# EAGLE schematic ADC3_2M (EAGLE 9.6.2)
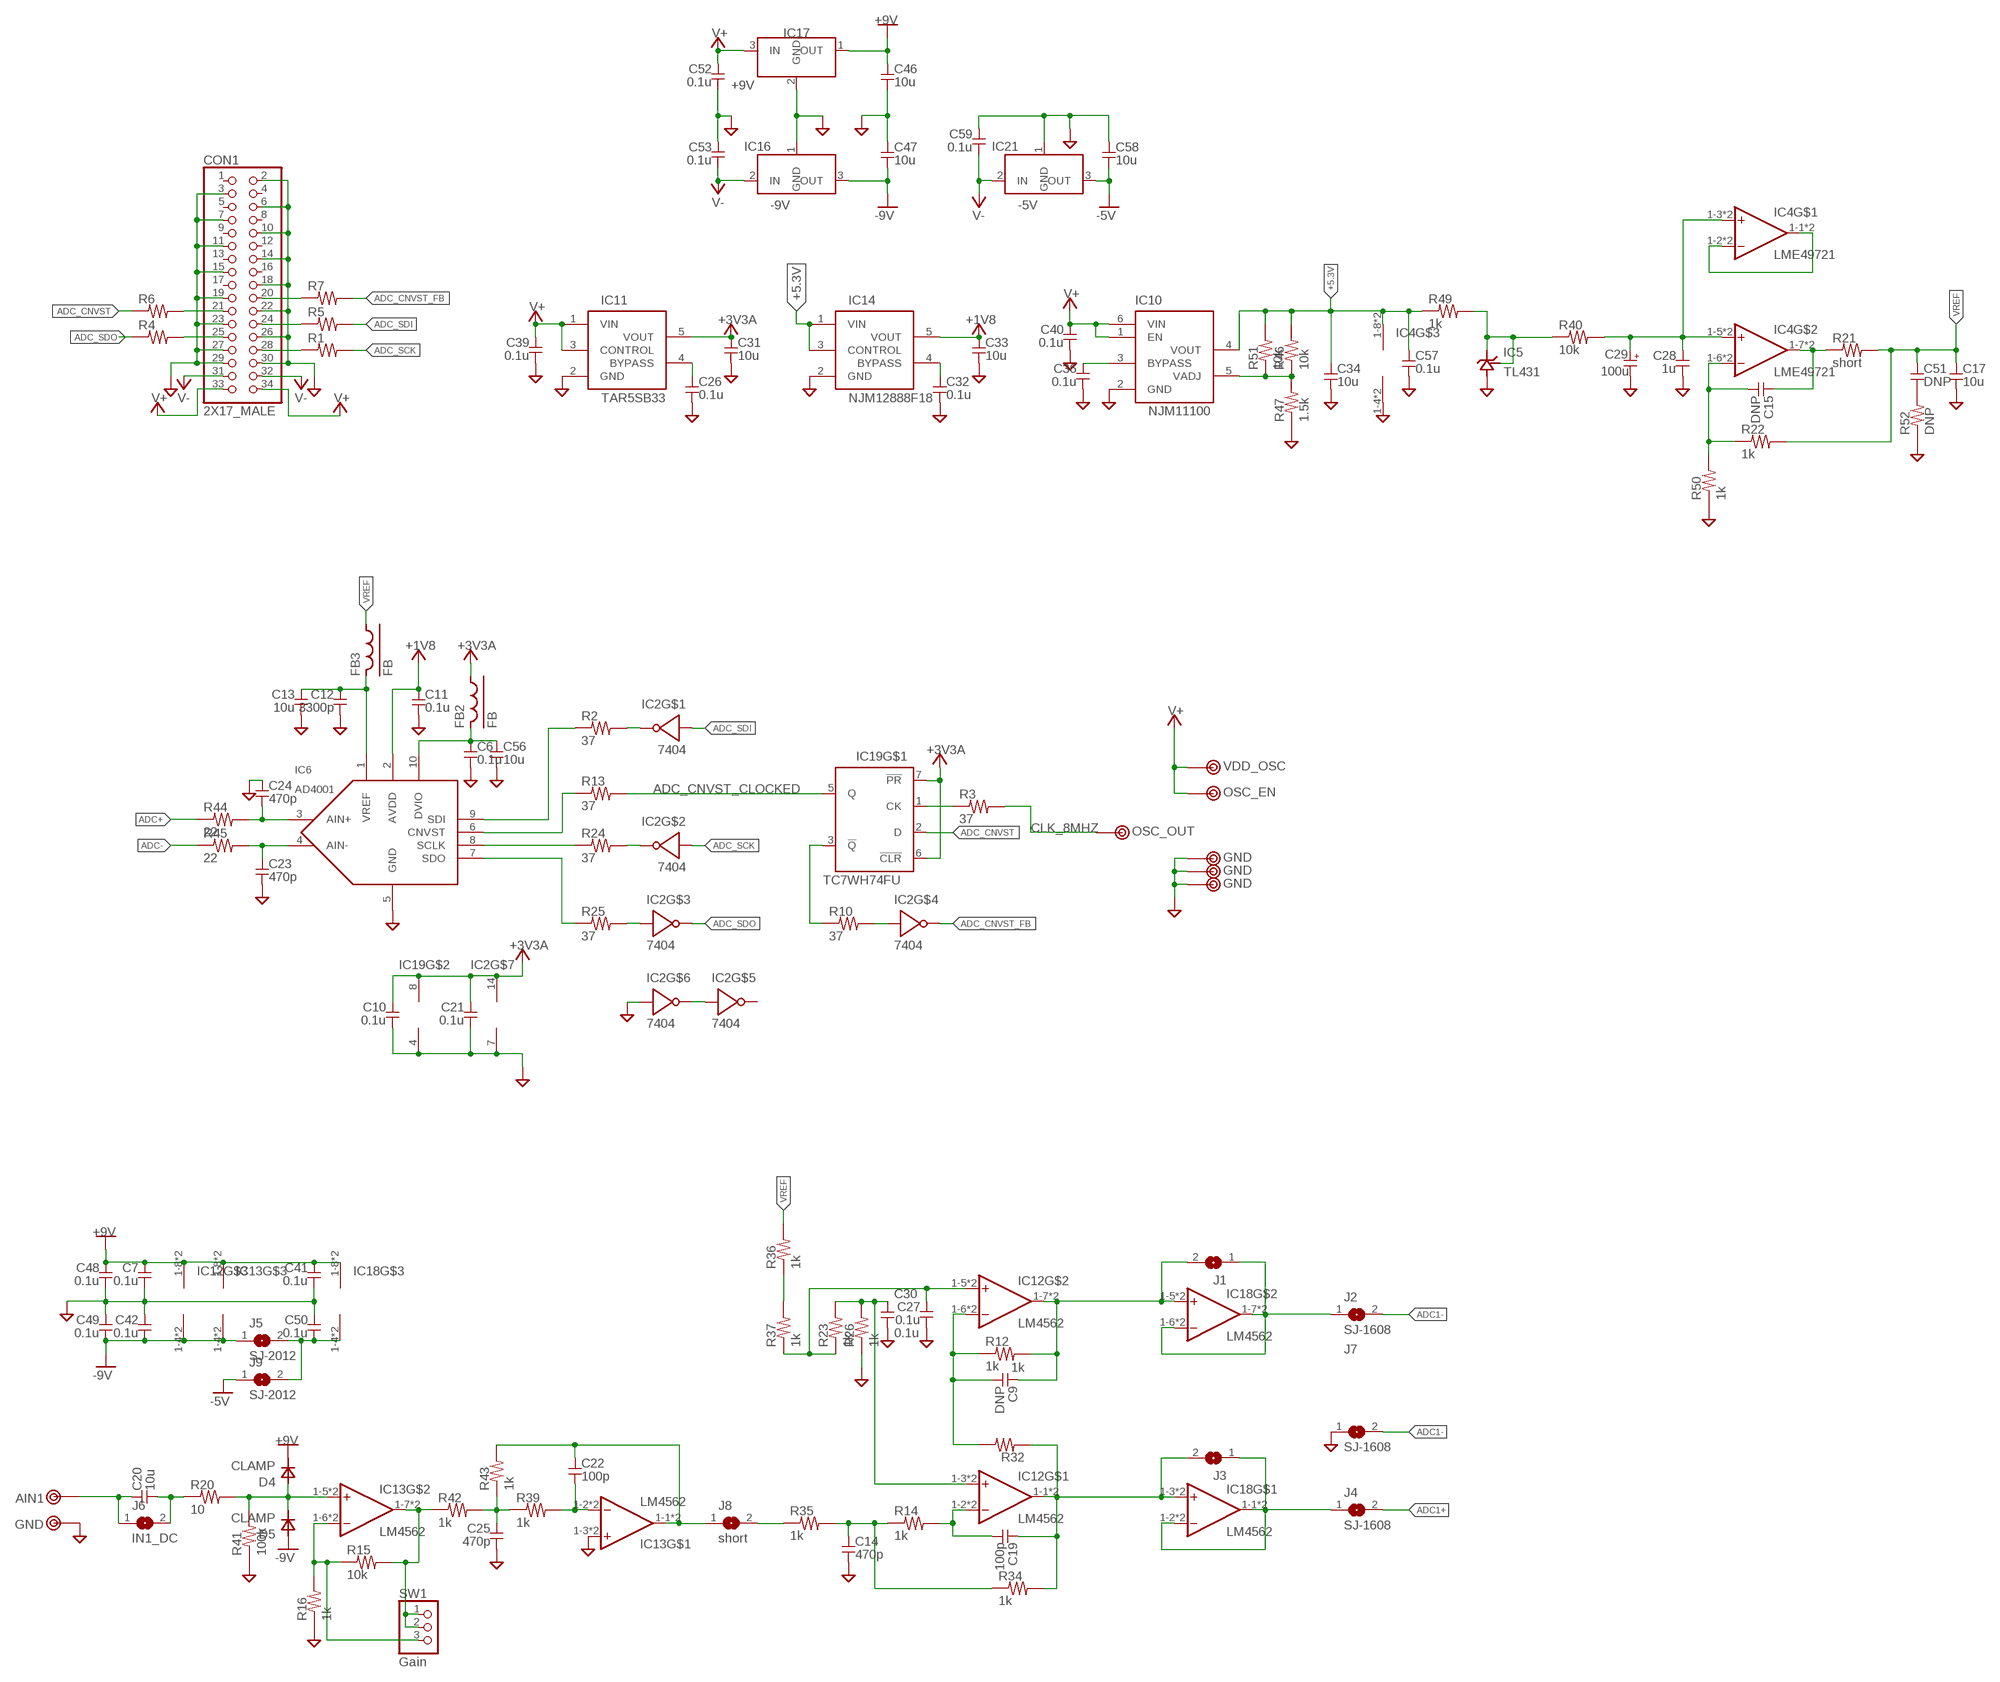
[diagram p0: schematic, sheet 1]

## Parts
C6  0.1u  C-1608  [1608]
C7  0.1u  C-1608  [1608]
C9  DNP  C-1608  [1608]
C10  0.1u  C-1608  [1608]
C11  0.1u  C-1608  [1608]
C12  3300p  C-1608  [1608]
C13  10u  C-2012  [2012]
C14  470p  C-1608  [1608]
C15  DNP  C-1608  [1608]
C17  10u  C-2012  [2012]
C19  100p  C-1608  [1608]
C20  10u  C-5  [C050]
C21  0.1u  C-1608  [1608]
C22  100p  C-1608  [1608]
C23  470p  C-1608  [1608]
C24  470p  C-1608  [1608]
C25  470p  C-1608  [1608]
C26  0.1u  C-1608  [1608]
C27  0.1u  C-1608  [1608]
C28  1u  C-1608  [1608]
C29  100u  CPOLE2.5-6.5  [E2.5-6.5]
C30  0.1u  C-1608  [1608]
C31  10u  C-2012  [2012]
C32  0.1u  C-1608  [1608]
C33  10u  C-2012  [2012]
C34  10u  C-2012  [2012]
C36  0.1u  C-1608  [1608]
C39  0.1u  C-1608  [1608]
C40  0.1u  C-1608  [1608]
C41  0.1u  C-1608  [1608]
C42  0.1u  C-1608  [1608]
C46  10u  C-3216  [3216]
C47  10u  C-3216  [3216]
C48  0.1u  C-1608  [1608]
C49  0.1u  C-1608  [1608]
C50  0.1u  C-1608  [1608]
C51  DNP  C-2012  [2012]
C52  0.1u  C-1608  [1608]
C53  0.1u  C-1608  [1608]
C56  10u  C-2012  [2012]
C57  0.1u  C-1608  [1608]
C58  10u  C-2012  [2012]
C59  0.1u  C-1608  [1608]
CON1  2X17_MALE  [2X17/90]
D4  CLAMP  DIODE-1N4148W  [SOD123]
D5  CLAMP  DIODE-1N4148W  [SOD123]
FB2  FB  [1608-J]
FB3  FB  [1608-J]
IC2  7404  [TSSOP14]
IC4  LME49721  OPA-2-DUAL  [DIL8-SOP8]
IC5  TL431  [TO-92]
IC6  AD4001  MCP331X1  [MSOP10]
IC10  NJM11100  [SOT23-6]
IC11  TAR5SB33  [SOT23-5]
IC12  LM4562  OPA-2-DUAL  [DIL8-SOP8]
IC13  LM4562  OPA-2-DUAL  [DIL8-SOP8]
IC14  NJM12888F18  NJM12888  [SOT23-5]
IC16  -9V  79LX  [TO-92]
IC17  +9V  78LX  [TO-92]
IC18  LM4562  OPA-2-DUAL  [DIL8-SOP8]
IC19  TC7WH74FU  [SSOP8-P-0.65]
IC21  -5V  79LX  [TO-92]
J1  SJ-2012  [2012-J]
J2  SJ-1608  [1608-J]
J3  SJ-2012  [2012-J]
J4  SJ-1608  [1608-J]
J5  SJ-2012  [2012-J]
J6  IN1_DC  SJ-2012  [2012-J]
J7  SJ-1608  [1608-J]
J8  short  SJ-2012  [2012-J]
J9  SJ-2012  [2012-J]
R1  R-1608J  [1608-J]
R2  37  R-1608J  [1608-J]
R3  37  R-1608J  [1608-J]
R4  R-1608J  [1608-J]
R5  R-1608J  [1608-J]
R6  R-1608J  [1608-J]
R7  R-1608J  [1608-J]
R10  37  R-1608J  [1608-J]
R12  1k  R-1608  [1608]
R13  37  R-1608J  [1608-J]
R14  1k  R-1608  [1608]
R15  10k  R-1608  [1608]
R16  1k  R-1608  [1608]
R20  10  R-1608J  [1608-J]
R21  short  R-1608J  [1608-J]
R22  1k  R-1608  [1608]
R23  1k  R-1608  [1608]
R24  37  R-1608J  [1608-J]
R25  37  R-1608J  [1608-J]
R26  1k  R-1608  [1608]
R32  1k  R-1608  [1608]
R34  1k  R-1608  [1608]
R35  1k  R-1608  [1608]
R36  1k  R-1608  [1608]
R37  1k  R-1608  [1608]
R39  1k  R-1608  [1608]
R40  10k  R-1608  [1608]
R41  100k  R-1608  [1608]
R42  1k  R-1608  [1608]
R43  1k  R-1608  [1608]
R44  22  R-1608  [1608]
R45  22  R-1608  [1608]
R46  10k  R-1608  [1608]
R47  1.5k  R-1608  [1608]
R49  1k  R-1608  [1608]
R50  1k  R-1608  [1608]
R51  10k  R-1608  [1608]
R52  DNP  R-2012  [2012]
SW1  Gain  SW-1X3  [1X03]
TP2  AIN1  TESTPIN-BIG  [TESTPIN-BIG]
TP16  GND  TESTPIN-BIG  [TESTPIN-BIG]
TP24  VDD_OSC  TESTPIN  [TESTPIN]
TP25  OSC_EN  TESTPIN  [TESTPIN]
TP26  OSC_OUT  TESTPIN  [TESTPIN]
TP27  GND  TESTPIN  [TESTPIN]
TP28  GND  TESTPIN  [TESTPIN]
TP29  GND  TESTPIN  [TESTPIN]

## Nets
+1V8: C11.1 C33.1 IC6.2(AVDD) IC14.5(VOUT)
+3V3A: C10.1 C21.1 C31.1 FB2.1 IC2.14(V+) IC11.5(VOUT) IC19.6(!CLR) IC19.7(!PR) IC19.8(V+)
+5.3V: C34.1 C57.1 IC4.1-8(V+) IC4.2-8(V+) IC10.4(VOUT) IC14.1(VIN) IC14.3(CONTROL) R46.2 R49.1 R51.2
+9V: C7.1 C41.1 C46.1 C48.1 D4.2(K) IC12.1-8(V+) IC12.2-8(V+) IC13.1-8(V+) IC13.2-8(V+) IC17.1(OUT) IC18.1-8(V+) IC18.2-8(V+)
-5V: C58.2 IC21.3(OUT) J9.1
-9V: C42.2 C47.2 C49.2 D5.1(A) IC12.1-4(V-) IC12.2-4(V-) IC13.1-4(V-) IC13.2-4(V-) IC16.3(OUT) J5.1
ADC1+: J4.2
ADC1-: J2.2 J7.2
ADC+: R44.1
ADC-: R45.1
ADC_CNVST: IC19.2(D) R6.1
ADC_CNVST_CLOCKED: IC19.5(Q) R13.2
ADC_CNVST_FB: IC2.8(OUT) R7.2
ADC_SCK: IC2.3(IN) R1.2
ADC_SDI: IC2.1(IN) R5.2
ADC_SDO: IC2.6(OUT) R4.1
CLK_8MHZ: R3.2 TP26.1
GND: C6.2 C7.2 C10.2 C11.2 C12.2 C13.2 C14.2 C17.2 C21.2 C23.2 C24.1 C25.2 C26.2 C27.2 C28.2 C29.- C30.2 C31.2 C32.2 C33.2 C34.2 C36.2 C39.2 C40.2 C41.2 C42.1 C46.2 C47.1 C48.2 C49.1 C50.1 C52.2 C53.1 C56.2 C57.2 C58.1 C59.1 CON1.2 CON1.3 CON1.6 CON1.7 CON1.10 CON1.11 CON1.14 CON1.15 CON1.18 CON1.19 CON1.22 CON1.23 CON1.26 CON1.27 CON1.29 CON1.30 IC2.7(V-) IC2.13(IN) IC4.1-4(V-) IC4.2-4(V-) IC5.2(GND) IC6.5(GND) IC10.2(GND) IC11.2(GND) IC13.1-3(+IN) IC13.2-3(+IN) IC14.2(GND) IC16.1(GND) IC17.2(GND) IC19.4(V-) IC21.1(GND) J7.1 R16.1 R26.1 R41.1 R47.1 R50.1 R52.1 TP16.1 TP27.1 TP28.1 TP29.1
N$1: CON1.28 R1.1
N$2: IC18.1-6(-IN) IC18.1-7(OUT) IC18.2-6(-IN) IC18.2-7(OUT) J1.1 J2.1
N$3: CON1.25 R4.2
N$4: C25.1 R39.1 R42.2 R43.1
N$5: IC18.1-1(OUT) IC18.1-2(-IN) IC18.2-1(OUT) IC18.2-2(-IN) J3.1 J4.1
N$6: CON1.24 R5.1
N$7: CON1.21 R6.2
N$8: CON1.20 R7.1
N$11: IC19.3(!Q) R10.1
N$12: C20.2 J6.2 R20.1
N$13: IC2.2(OUT) R2.2
N$14: C9.1 IC12.1-7(OUT) IC12.2-7(OUT) IC18.1-5(+IN) IC18.2-5(+IN) J1.2 R12.2
N$15: C6.1 C56.1 FB2.2 IC6.10(DVIO)
N$16: C12.1 C13.1 FB3.2 IC6.1(VREF)
N$18: IC19.1(CK) R3.1
N$19: IC2.9(IN) R10.2
N$20: IC2.5(IN) R25.2
N$22: IC2.11(IN) IC2.12(OUT)
N$23: C15.1 IC4.1-7(OUT) IC4.2-7(OUT) R21.1
N$24: J8.2 R35.1
N$25: IC6.7(SDO) R25.1
N$26: C19.2 IC12.1-2(-IN) IC12.2-2(-IN) R14.2
N$28: IC6.8(SCLK) R24.1
N$29: IC6.6(CNVST) R13.1
N$30: IC6.9(SDI) R2.1
N$31: IC2.4(OUT) R24.2
N$38: R36.1 R37.2
N$39: IC13.1-6(-IN) IC13.2-6(-IN) R15.1 R16.2 SW1.3
N$41: C27.1 IC12.1-5(+IN) IC12.2-5(+IN) R23.1 R37.1
N$42: C9.2 IC12.1-6(-IN) IC12.2-6(-IN) R12.1 R32.2
N$43: C14.1 R14.1 R34.1 R35.2
N$44: C30.1 IC12.1-3(+IN) IC12.2-3(+IN) R23.2 R26.2
N$45: IC13.1-7(OUT) IC13.2-7(OUT) R15.2 R42.1 SW1.1 SW1.2
N$47: C19.1 IC12.1-1(OUT) IC12.2-1(OUT) IC18.1-3(+IN) IC18.2-3(+IN) J3.2 R32.1 R34.2
N$48: C20.1 J6.1 TP2.1
N$49: D4.1(A) D5.2(K) IC13.1-5(+IN) IC13.2-5(+IN) R20.2 R41.2
N$52: C24.2 IC6.3(AIN+) R44.2
N$53: C23.1 IC6.4(AIN-) R45.2
N$55: C22.2 IC13.1-2(-IN) IC13.2-2(-IN) R39.2
N$56: C26.1 IC11.4(BYPASS)
N$57: C22.1 IC13.1-1(OUT) IC13.2-1(OUT) J8.1 R43.2
N$58: C15.2 IC4.1-6(-IN) IC4.2-6(-IN) R22.1 R50.2
N$59: C32.1 IC14.4(BYPASS)
N$60: IC5.1(REF) IC5.3(OUT) R40.1 R49.2
N$61: C36.1 IC10.3(BYPASS)
N$62: IC10.5(VADJ) R46.1 R47.2 R51.1
N$63: C28.1 C29.+ IC4.1-3(+IN) IC4.1-5(+IN) IC4.2-3(+IN) IC4.2-5(+IN) R40.2
N$64: IC4.1-1(OUT) IC4.1-2(-IN) IC4.2-1(OUT) IC4.2-2(-IN)
N$73: C51.2 R52.2
N$74: C50.2 IC18.1-4(V-) IC18.2-4(V-) J5.2 J9.2
V+: C39.1 C40.1 C52.1 CON1.33 CON1.34 IC10.1(EN) IC10.6(VIN) IC11.1(VIN) IC11.3(CONTROL) IC17.3(IN) TP24.1 TP25.1
V-: C53.2 C59.2 CON1.31 CON1.32 IC16.2(IN) IC21.2(IN)
VREF: C17.1 C51.1 FB3.1 R21.2 R22.2 R36.2
Unconnected: CON1.1 CON1.4 CON1.5 CON1.8 CON1.9 CON1.12 CON1.13 CON1.16 CON1.17 IC2.10(OUT)

## Library data of the parts
C6 C7 C9-C15 C17 C19-C28 C30-C34 C36 C39-C42 C46-C53 C56-C59 = my_rcl:C
C29 = my_rcl:CPOL
CON1 = my_connector:2X17_MALE
D4 D5 = my_rcl:DIODE
FB2 FB3 = my_rcl:FB
IC2 = my_ic:7404
IC4 IC12 IC13 IC18 = my_ic:OPA-2
IC5 = my_ic:TL431
IC6 = my_ic:MCP331X1
IC10 = my_ic:NJM11100
IC11 = my_ic:TAR5SB33
IC14 = my_ic:NJM12888
IC16 IC21 = my_ic:79LX
IC17 = my_ic:78LX
IC19 = my_ic:TC7WH74FU
J1-J9 = my_rcl:SJ
R1-R7 R10 R12-R16 R20-R26 R32 R34-R37 R39-R47 R49-R52 = my_rcl:R
SW1 = my_connector:SW-1X3: PIN HEADER
TP2 TP16 TP24-TP29 = my_connector:TESTPIN